# EAGLE design GRBL_Nano_V2 (EAGLE 9.5.2)
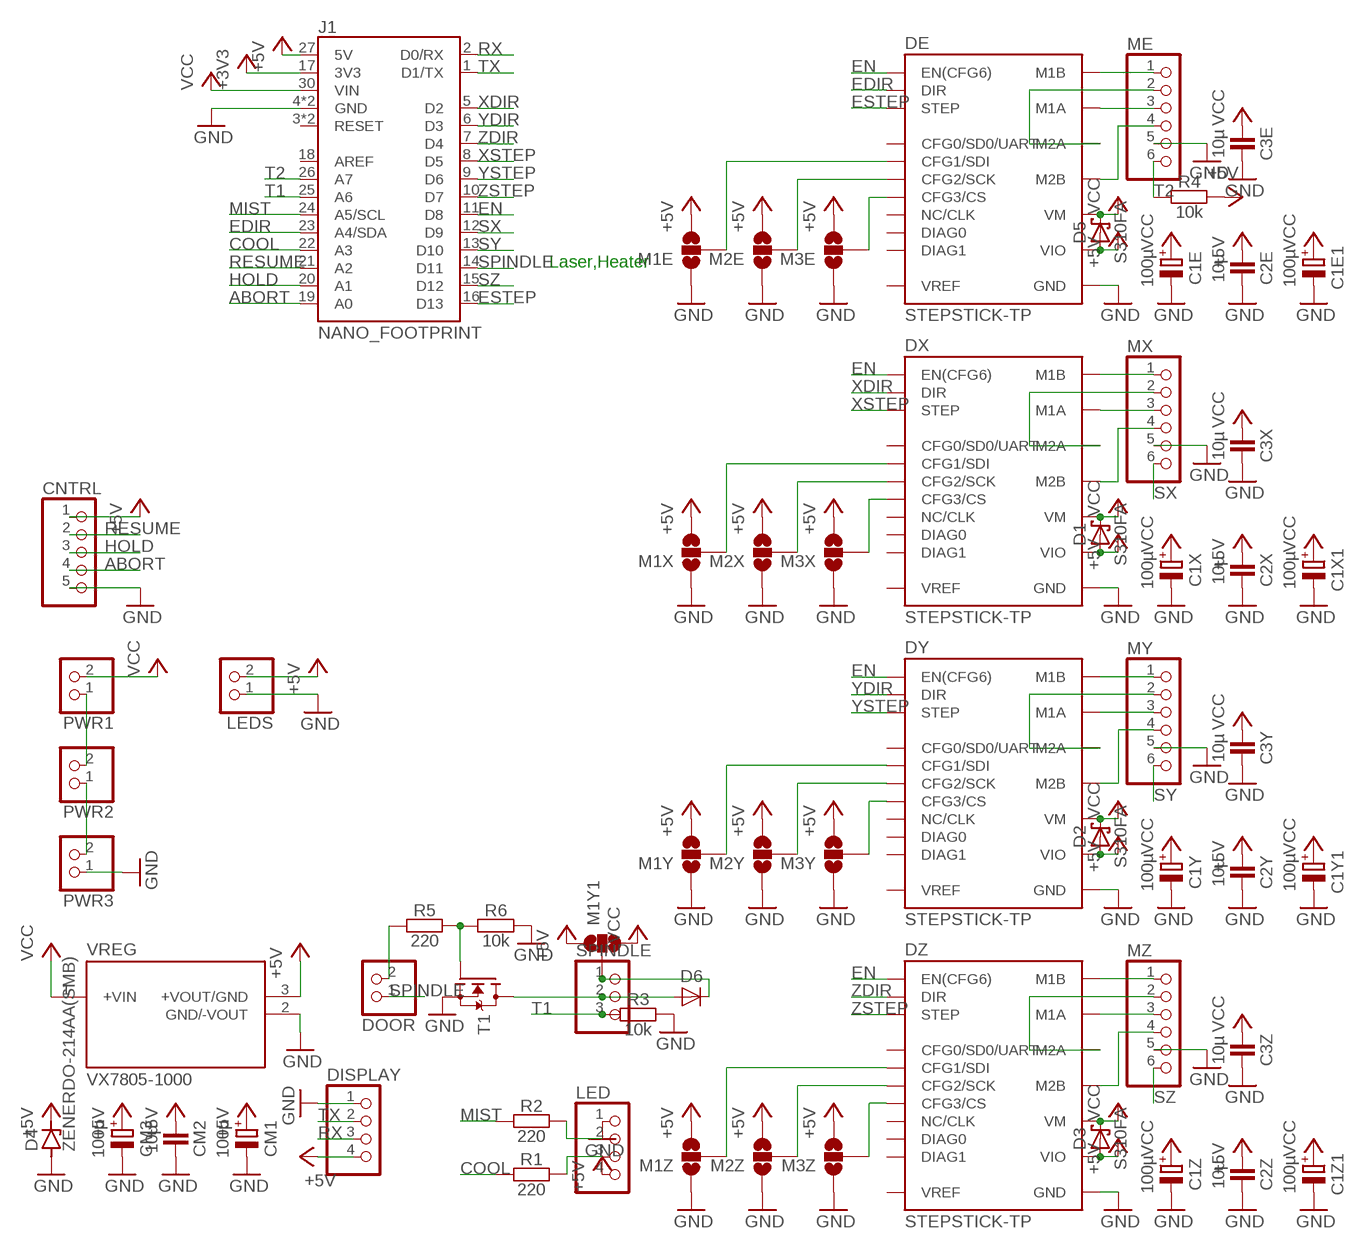
[diagram p0: schematic, sheet 1]

## Parts
C1E  100µ  CAPACITOR_POL-8MM  [C_8MM]
C1E1  100µ  CAPACITOR_POL-E5-10  [C_E5-10]
C1X  100µ  CAPACITOR_POL-8MM  [C_8MM]
C1X1  100µ  CAPACITOR_POL-E5-10  [C_E5-10]
C1Y  100µ  CAPACITOR_POL-8MM  [C_8MM]
C1Y1  100µ  CAPACITOR_POL-E5-10  [C_E5-10]
C1Z  100µ  CAPACITOR_POL-8MM  [C_8MM]
C1Z1  100µ  CAPACITOR_POL-E5-10  [C_E5-10]
C2E  10µ  CAPACITOR-0805  [C0805]
C2X  10µ  CAPACITOR-0805  [C0805]
C2Y  10µ  CAPACITOR-0805  [C0805]
C2Z  10µ  CAPACITOR-0805  [C0805]
C3E  10µ  CAPACITOR-0805  [C0805]
C3X  10µ  CAPACITOR-0805  [C0805]
C3Y  10µ  CAPACITOR-0805  [C0805]
C3Z  10µ  CAPACITOR-0805  [C0805]
CM1  100µ  CAPACITOR_POL-8MM  [C_8MM]
CM2  10µ  CAPACITOR-0805  [C0805]
CM3  100µ  CAPACITOR_POL-E5-10  [C_E5-10]
CNTRL  PINHD-1X5  [1X05]
D1  S310FA  D_SCHOTTKY-SOD123  [SOD123]
D2  S310FA  D_SCHOTTKY-SOD123  [SOD123]
D3  S310FA  D_SCHOTTKY-SOD123  [SOD123]
D4  ZENERDO-214AA(SMB)  [DIOM5336X265N]
D5  S310FA  D_SCHOTTKY-SOD123  [SOD123]
D6  DIODE-SMA  [SMA_DO214AC]
DE  STEPSTICK-TP  [SSS_TP]
DISPLAY  PINHD-1X4  [1X04]
DOOR  PINHD-1X2  [1X02]
DX  STEPSTICK-TP  [SSS_TP]
DY  STEPSTICK-TP  [SSS_TP]
DZ  STEPSTICK-TP  [SSS_TP]
J1  NANO_FOOTPRINT  [NANO]
LED  PINHD-1X4  [1X04]
LEDS  PINHD-1X2  [1X02]
M1E  SOLDERJUMPER_2WAY-OLDS  [SJ_3]
M1X  SOLDERJUMPER_2WAY-OLDS  [SJ_3]
M1Y  SOLDERJUMPER_2WAY-OLDS  [SJ_3]
M1Y1  SOLDERJUMPER_2WAY-OLDS  [SJ_3]
M1Z  SOLDERJUMPER_2WAY-OLDS  [SJ_3]
M2E  SOLDERJUMPER_2WAY-OLDS  [SJ_3]
M2X  SOLDERJUMPER_2WAY-OLDS  [SJ_3]
M2Y  SOLDERJUMPER_2WAY-OLDS  [SJ_3]
M2Z  SOLDERJUMPER_2WAY-OLDS  [SJ_3]
M3E  SOLDERJUMPER_2WAY-OLDS  [SJ_3]
M3X  SOLDERJUMPER_2WAY-OLDS  [SJ_3]
M3Y  SOLDERJUMPER_2WAY-OLDS  [SJ_3]
M3Z  SOLDERJUMPER_2WAY-OLDS  [SJ_3]
ME  PINHD-1X6  [1X06]
MX  PINHD-1X6  [1X06]
MY  PINHD-1X6  [1X06]
MZ  PINHD-1X6  [1X06]
PWR1  PINHD-1X2  [1X02]
PWR2  PINHD-1X2  [1X02]
PWR3  PINHD-1X2  [1X02]
R1  220  RESISTOR-0805  [C0805]
R2  220  RESISTOR-0805  [C0805]
R3  10k  RESISTOR-0805  [C0805]
R4  10k  RESISTOR-0805  [C0805]
R5  220  RESISTOR-0805  [C0805]
R6  10k  RESISTOR-0805  [C0805]
SPINDLE  PINHD-1X3  [1X03]
T1  MOSFET-N-DPAK  [DPAK_TO252]
VREG  VX7805-1000  [VX78012-1000_VX7805-1000]

## Nets
+3V3: J1.17(3V3)
+5V: C2E.1 C2X.1 C2Y.1 C2Z.1 CM1.+ CM2.1 CM3.+ CNTRL.1 D1.A D2.A D3.A D4.2(C) D5.A DE.VIO DISPLAY.4 DX.VIO DY.VIO DZ.VIO J1.27(5V) LED.4 LEDS.2 M1E.3 M1X.3 M1Y1.1 M1Y.3 M1Z.3 M2E.3 M2X.3 M2Y.3 M2Z.3 M3E.3 M3X.3 M3Y.3 M3Z.3 R4.2 VREG.3(+VOUT/GND)
ABORT: CNTRL.4 J1.19(A0)
COOL: J1.22(A3) R1.1
COOL1: LED.3 R1.2
EDIR: DE.DIR J1.23(A4/SDA)
EN: DE.EN(EN(CFG6)) DX.EN(EN(CFG6)) DY.EN(EN(CFG6)) DZ.EN(EN(CFG6)) J1.11(D8)
ESTEP: DE.STEP J1.16(D13)
GND: C1E1.- C1E.- C1X1.- C1X.- C1Y1.- C1Y.- C1Z1.- C1Z.- C2E.2 C2X.2 C2Y.2 C2Z.2 C3E.2 C3X.2 C3Y.2 C3Z.2 CM1.- CM2.2 CM3.- CNTRL.5 D4.1(A) DE.GND@1(GND) DE.GND@2(GND) DISPLAY.1 DX.GND@1(GND) DX.GND@2(GND) DY.GND@1(GND) DY.GND@2(GND) DZ.GND@1(GND) DZ.GND@2(GND) J1.4(GND) J1.29(GND) LED.1 LEDS.1 M1E.1 M1X.1 M1Y.1 M1Z.1 M2E.1 M2X.1 M2Y.1 M2Z.1 M3E.1 M3X.1 M3Y.1 M3Z.1 ME.5 MX.5 MY.5 MZ.5 PWR3.1 R3.2 R6.2 T1.3(S) VREG.2(GND/-VOUT)
HOLD: CNTRL.3 J1.20(A1)
MIST: J1.24(A5/SCL) R2.1
MIST1: LED.2 R2.2
N$1: DX.M1A MX.3
N$2: DX.M2B MX.4
N$3: DX.M2A MX.2
N$4: DX.M1B MX.1
N$5: DZ.M1B MZ.1
N$6: DZ.M1A MZ.3
N$7: DY.M1B MY.1
N$8: DY.M1A MY.3
N$9: DY.M2A MY.2
N$10: DZ.M2A MZ.2
N$11: DZ.M2B MZ.4
N$12: DY.M2B MY.4
N$13: D6.A SPINDLE.2 T1.2(D)
N$14: DOOR.2 R5.1
N$15: DX.CFG1(CFG1/SDI) M1X.2
N$16: DX.CFG2(CFG2/SCK) M2X.2
N$17: DX.CFG3(CFG3/CS) M3X.2
N$18: DY.CFG1(CFG1/SDI) M1Y.2
N$19: DY.CFG2(CFG2/SCK) M2Y.2
N$20: DY.CFG3(CFG3/CS) M3Y.2
N$21: DZ.CFG1(CFG1/SDI) M1Z.2
N$22: DZ.CFG2(CFG2/SCK) M2Z.2
N$23: DZ.CFG3(CFG3/CS) M3Z.2
N$24: DE.M2B ME.4
N$25: DE.M1B ME.1
N$26: PWR1.1 PWR2.2
N$27: D6.C M1Y1.2 SPINDLE.1
N$28: PWR2.1 PWR3.2
N$29: DE.M1A ME.3
N$30: DE.M2A ME.2
N$31: DE.CFG1(CFG1/SDI) M1E.2
N$32: DE.CFG2(CFG2/SCK) M2E.2
N$33: DE.CFG3(CFG3/CS) M3E.2
N$34: R5.2 R6.1 T1.1(G)
RESUME: CNTRL.2 J1.21(A2)
RX: DISPLAY.3 J1.2(D0/RX)
SPINDLE: DOOR.1 J1.14(D11)
SX: J1.12(D9) MX.6
SY: J1.13(D10) MY.6
SZ: J1.15(D12) MZ.6
T1: J1.25(A6) R3.1 SPINDLE.3
T2: J1.26(A7) ME.6 R4.1
TX: DISPLAY.2 J1.1(D1/TX)
VCC: C1E1.+ C1E.+ C1X1.+ C1X.+ C1Y1.+ C1Y.+ C1Z1.+ C1Z.+ C3E.1 C3X.1 C3Y.1 C3Z.1 D1.C D2.C D3.C D5.C DE.VM DX.VM DY.VM DZ.VM J1.30(VIN) M1Y1.3 PWR1.2 VREG.1(+VIN)
XDIR: DX.DIR J1.5(D2)
XSTEP: DX.STEP J1.8(D5)
YDIR: DY.DIR J1.6(D3)
YSTEP: DY.STEP J1.9(D6)
ZDIR: DZ.DIR J1.7(D4)
ZSTEP: DZ.STEP J1.10(D7)
Unconnected: DE.CFG0/NC(CFG0/SD0/UART) DE.CLK/NC(NC/CLK) DE.DIAG0 DE.DIAG1 DE.VREF DX.CFG0/NC(CFG0/SD0/UART) DX.CLK/NC(NC/CLK) DX.DIAG0 DX.DIAG1 DX.VREF DY.CFG0/NC(CFG0/SD0/UART) DY.CLK/NC(NC/CLK) DY.DIAG0 DY.DIAG1 DY.VREF DZ.CFG0/NC(CFG0/SD0/UART) DZ.CLK/NC(NC/CLK) DZ.DIAG0 DZ.DIAG1 DZ.VREF J1.3(RESET) J1.18(AREF) J1.28(RESET)

## Notes on the sheet
- Laser,Heater

## Library data of the parts
C1E C1E1 C1X C1X1 C1Y C1Y1 C1Z C1Z1 CM1 CM3 = we-rcl:CAPACITOR_POL: Capacitor (Polarized)
C2E C2X C2Y C2Z C3E C3X C3Y C3Z CM2 = we-rcl:CAPACITOR: Capacitor ...2.2uF @ 6.3V -> 0402 ...4.7uF @ 6.3V -> 0603 ...10uF @ 16V -> 0805 ...22uF @ 25V -> 1206
CNTRL = Connector:PINHD-1X5: PIN HEADER; CATEGORY: CONNECTOR; SUB-CATEGORY: PIN-HEADER
D1-D3 D5 = we-rcl:D_SCHOTTKY: Schottky Diode 1A, 30V - SOD323 (BAS3010B) 3A, 100V - SOD123 (S310A)
D4 = Diode:ZENER: Zener Diode - Generic; CATEGORY: Diode; SUB-CATEGORY: Zener
D6 = we-rcl:DIODE: Diode
DE DX DY DZ = we-board:STEPSTICK: SilentStepStick Trinamic TMC2xxx Stepper Motor Driver TMC2100 - CFG pins for configuration TMC2130 - CFG pins and SPI for configuration TMC220x - CFG pins and UART for configuration
DISPLAY LED = Connector:PINHD-1X4: PIN HEADER; CATEGORY: CONNECTOR; SUB-CATEGORY: PIN-HEADER
DOOR LEDS PWR1-PWR3 = Connector:PINHD-1X2: PIN HEADER; CATEGORY: CONNECTOR; SUB-CATEGORY: PIN-HEADER
J1 = SparkFun-Boards:NANO_FOOTPRINT: Generic Nano Footprint
M1E M1X M1Y M1Y1 M1Z M2E M2X M2Y M2Z M3E M3X M3Y M3Z = SparkFun-Retired:SOLDERJUMPER_2WAY-OLD: Solder Jumper 2 way solder jumper
ME MX MY MZ = Connector:PINHD-1X6: PIN HEADER; CATEGORY: CONNECTOR; SUB-CATEGORY: PIN-HEADER
R1-R6 = we-rcl:RESISTOR: Resistor all kinds in 0402 and 0603
SPINDLE = Connector:PINHD-1X3: PIN HEADER; CATEGORY: CONNECTOR; SUB-CATEGORY: PIN-HEADER
T1 = we-transistor:MOSFET-N: N-Chn MOSFET SOT23 N-Chn MOSFET TSM3404, TSM240N03 (Vgs>=+/-20V, Vds>=30V, Id>=3A + Rds<=0.05Ohm @ Vgs=4.5V) BSS138 (Vgs>=+/-20V, Vds>=40V, Id>=0.2A + Rds<=3Ohm @ Vgs=4.5V) SOT223 Low Side Switch with Protection (Infineon) BSP76 (Vin=0...10V, Vds=42V, Id=1.4A + Rds=0.2Ohm @ Vin=5V) BSP77 (Vin=0...10V, Vds=42V, Id=2.2A + Rds=0.1Ohm @ Vin=5V) D²Pak Low Side Switch with Protection (Infineon) BTS117TC (Vin=0...10V, Vds=60V, Id=3.5A + Rds=0.12Ohm @ Vin=5V) BTS133TC (Vin=0...10V, Vds=60V, Id=7A + Rds=0.06Ohm @ Vin=5V) BTS141TC (Vin=0...10V, Vds=60V, Id=12A + Rds=0.03Ohm @ Vin=5V) BTS3018TC (Vin=0...10V, Vds=60V, Id=6A + Rds=0.02Ohm @ Vin=5V)
VREG = VX7805-1000:VX7805-1000: Check availability <https://pricing.snapeda.com/parts/VX7805-1000/CUI%20Inc./view-part?ref=eda>; AVAILABILITY: In Stock; CHECK_PRICES: https://www.snapeda.com/parts/VX7805-1000/CUI/view-part/?ref=eda; CUI_PURCHASE_URL: https://www.cui.com/product/dc-dc-converters/non-isolated/vx78-1000-series?utm_source=snapeda.com&utm_medium=referral&utm_campaign=snapedaBOM; DESCRIPTION: 1 A Output Current, 6~36 Vdc Input, 3 Pin SIP, Non-Isolated, Dc-Dc Converter; MF: CUI Inc.; MP: VX7805-1000; PACKAGE: SIP-3 CUI; PRICE: None; SNAPEDA_LINK: https://www.snapeda.com/parts/VX7805-1000/CUI/view-part/?ref=snap

## Board
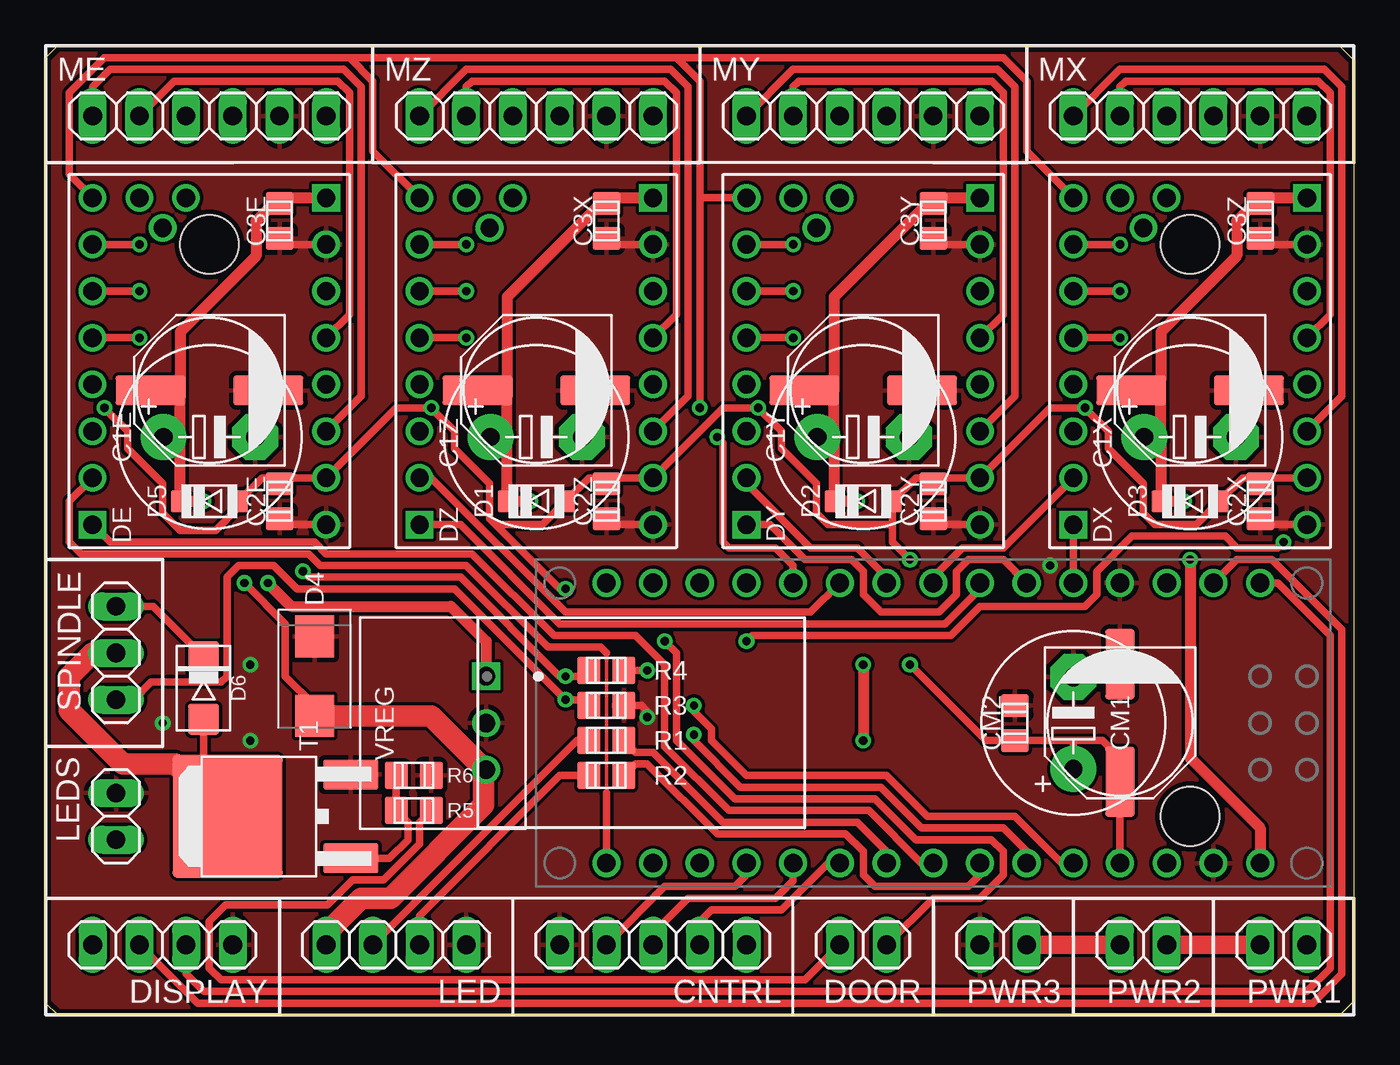
[diagram p1: board, top side]
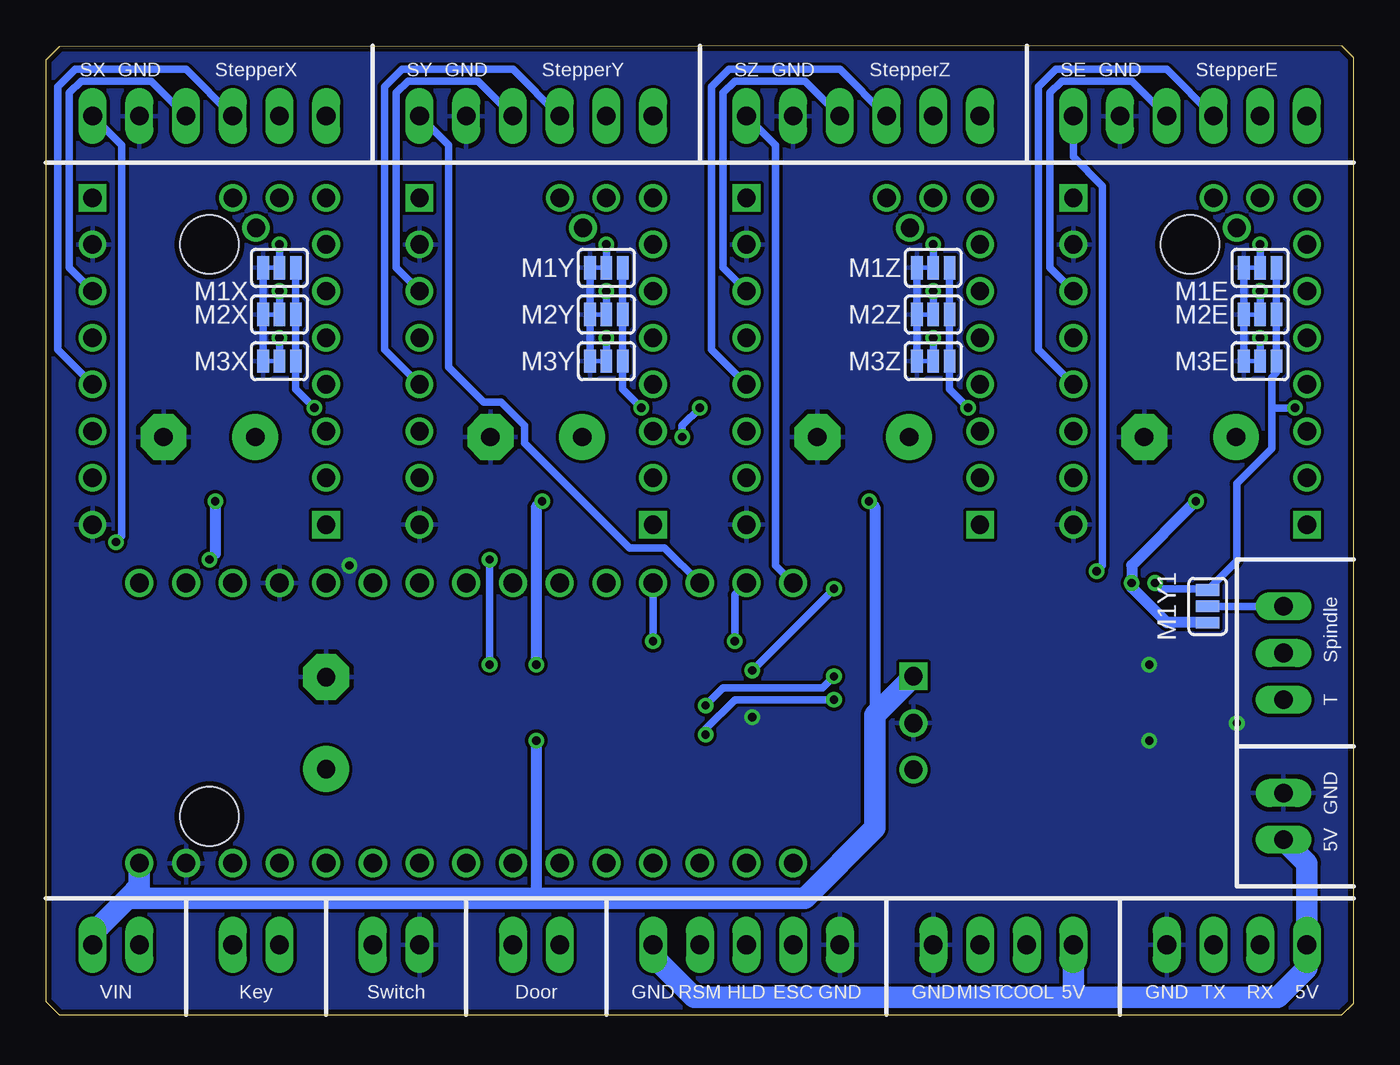
[diagram p2: board, bottom side, seen from below]

Size 71.12 x 52.7 mm. Coordinates in mm from the lower left corner, seen from the top.
Outline: 71.12,0.73 70.39,0 0.64,0 0,0.64 0,52.07 0.64,52.7 70.39,52.65 71.12,51.92 71.12,0.73
Copper layers (1*16): Top 0.035mm / dielectric 1.5mm / Bottom 0.035mm
Design rules "aisler_2_layer_simple": minimum track width 0.2mm, minimum drill 0.45mm, track to track 0.175mm, track to pad 0.175mm, pad to pad 0.175mm, via to via 0.175mm, smd to smd 0.175mm, copper to edge 0.3mm, drill to drill 0.25mm, minimum pad ring 0.2mm, minimum via ring 0.2mm, stop-mask expansion 0mil, vias tented up to drill 0mil, thermal gap 10mil
Holes 3.2 mm at 62.23,10.79 62.23,41.91 8.89,41.91

### Footprints (pad centres in the part's own frame; a part is rotated, then mirrored left to right if it is on the bottom)
C_8MM = smd 1.6 x 3.8: + 0,3.2; - 0,-3.2
C_E5-10 = drill 1 pad 2.5: + 0,2.5 | drill 1 pad 2.5 octagon: - 0,-2.5
C0805 = smd 1.5 x 1.25: 1 0,0.95; 2 0,-0.95
1X05 = drill 1.016 long: 1 -5.08,0; 2 -2.54,0; 3 0,0; 4 2.54,0; 5 5.08,0
SOD123 = smd 1.2 x 1: A 0,-1.6; C 0,1.6
DIOM5336X265N = smd 2.284 x 2.124: 1 -2.164,0; 2 2.164,0
SMA_DO214AC = smd 1.7 x 1.7: A 0,-1.7; C 0,1.7
SSS_TP = drill 1: CFG0/NC -6.35,-1.27; CFG1 -6.35,6.35; CFG2 -6.35,3.81; CFG3 -6.35,1.27; CLK/NC -6.35,-3.81; DIAG0 -2.54,7.239; DIAG1 -1.27,8.89; EN -6.35,8.89; GND@1 6.35,6.35; GND@2 6.35,-8.89; M1A 6.35,-1.27; M1B 6.35,-3.81; M2A 6.35,1.27; M2B 6.35,3.81; STEP -6.35,-6.35; VIO 6.35,-6.35; VREF -3.81,8.89 | drill 1 square: DIR -6.35,-8.89; VM 6.35,8.89
1X04 = drill 1.016 long: 1 -3.81,0; 2 -1.27,0; 3 1.27,0; 4 3.81,0
1X02 = drill 1.016 long: 1 -1.27,0; 2 1.27,0
NANO = drill 1.016: 1 -7.62,17.78; 2 -7.62,15.24; 3 -7.62,12.7; 4 -7.62,10.16; 5 -7.62,7.62; 6 -7.62,5.08; 7 -7.62,2.54; 8 -7.62,0; 9 -7.62,-2.54; 10 -7.62,-5.08; 11 -7.62,-7.62; 12 -7.62,-10.16; 13 -7.62,-12.7; 14 -7.62,-15.24; 15 -7.62,-17.78; 16 7.62,-17.78; 17 7.62,-15.24; 18 7.62,-12.7; 19 7.62,-10.16; 20 7.62,-7.62; 21 7.62,-5.08; 22 7.62,-2.54; 23 7.62,0; 24 7.62,2.54; 25 7.62,5.08; 26 7.62,7.62; 27 7.62,10.16; 28 7.62,12.7; 29 7.62,15.24; 30 7.62,17.78
SJ_3 = smd 0.635 x 1.27: 1 -0.889,0; 2 0,0; 3 0.889,0
1X06 = drill 1.016 long: 1 -6.35,0; 2 -3.81,0; 3 -1.27,0; 4 1.27,0; 5 3.81,0; 6 6.35,0
1X03 = drill 1.016 long: 1 -2.54,0; 2 0,0; 3 2.54,0
DPAK_TO252 = smd 3 x 1.6: 1 -4.2,2.28; 3 -4.2,-2.28 | smd 6 x 6.7: 2 2.5,0
VX78012-1000_VX7805-1000 = drill 1 square: 1 -2.54,2.35 | drill 1: 2 0,2.35; 3 2.54,2.35

### Placement (x,y rotation side)
C1E  8.89,33.97 90 top
C1E1  8.89,31.43 90 top
C1X  62.23,33.97 90 top
C1X1  26.67,31.43 90 top
C1Y  44.45,33.97 90 top
C1Y1  44.45,31.43 90 top
C1Z  26.67,33.97 90 top
C1Z1  62.23,31.43 90 top
C2E  12.7,27.94 0 top
C2X  66.04,27.94 0 top
C2Y  48.26,27.94 0 top
C2Z  30.48,27.94 0 top
C3E  12.7,43.18 0 top
C3X  30.48,43.18 0 top
C3Y  48.26,43.18 0 top
C3Z  66.04,43.18 0 top
CM1  58.42,15.88 180 top
CM2  52.7,15.88 180 top
CM3  55.88,15.88 180 top
CNTRL  33.02,3.81 180 top
D1  26.67,27.94 90 top
D2  44.45,27.94 90 top
D3  62.23,27.94 90 top
D4  14.61,18.41 270 top
D5  8.89,27.94 90 top
D6  8.57,17.78 0 top
DE  8.89,35.56 0 top
DISPLAY  6.35,3.81 180 top
DOOR  44.45,3.81 180 top
DX  62.23,35.56 0 top
DY  44.45,35.56 0 top
DZ  26.67,35.56 0 top
J1  48.26,15.88 270 top
LED  19.05,3.81 180 top
LEDS  3.81,10.79 270 top
M1E  5.08,40.64 0 bottom
M1X  58.42,40.64 0 bottom
M1Y  40.64,40.64 0 bottom
M1Y1  7.94,22.23 270 bottom
M1Z  22.86,40.64 0 bottom
M2E  5.08,38.1 0 bottom
M2X  58.42,38.1 0 bottom
M2Y  40.64,38.1 0 bottom
M2Z  22.86,38.1 0 bottom
M3E  5.08,35.56 0 bottom
M3X  58.42,35.56 0 bottom
M3Y  40.64,35.56 0 bottom
M3Z  22.86,35.56 0 bottom
ME  8.89,48.9 0 top
MX  62.23,48.9 0 top
MY  44.45,48.9 0 top
MZ  26.67,48.9 0 top
PWR1  67.31,3.81 0 top
PWR2  59.69,3.81 0 top
PWR3  52.07,3.81 0 top
R1  30.48,14.92 270 top
R2  30.48,13.02 270 top
R3  30.48,16.83 90 top
R4  30.48,18.73 90 top
R5  20,11.11 270 top
R6  20,13.02 90 top
SPINDLE  3.81,19.68 270 top
T1  12.38,10.79 180 top
VREG  21.59,15.88 270 top

### Tracks (layer width: path | path; a pad name or v marks a point on that pad's centre or on a via)
+5V  (via drill 0.45)
  Top 0.406: DX.VIO 66.36,29.21 C2X.1 65.72,28.89 65.41,29.21 65.1,29.21 D3.A 62.56,26.67 60.32,26.67 59.69,27.3 59.69,28.89 57.78,30.8 57.78,31.75 v56.52,33.02 54.61,33.02 DY.VIO 48.58,29.21 C2Y.1 47.94,29.21 47.32,29.21 D2.A 46.04,27.93 46.04,26.67 | J1.27 CM1.+ 58.42,13.97 57.47,14.93 55.88,14.93 | 55.88,14.93 CM2.1 51.12,14.93 v46.99,19.05 | 24.45,26.67 24.13,26.99 24.13,28.89 22.23,30.8 22.23,31.75 v20.95,33.02 19.05,33.02 DE.VIO 13.02,29.21 C2E.1 12.38,28.89 12.06,29.21 11.76,29.21 D5.A 10.49,27.62 9.22,26.35 7.3,26.35 6.35,27.3 6.35,28.89 4.45,30.8 4.45,31.75 v3.17,33.02 | 46.04,26.67 42.55,26.67 41.91,27.3 41.91,28.89 40.01,30.8 40.01,31.75 v38.73,33.02 36.83,33.02 DZ.VIO 30.8,29.21 C2Z.1 30.16,28.89 29.84,29.21 29.54,29.21 D1.A 27,26.67 24.45,26.67 | R4.2 v32.7,18.73 | v28.26,23.18 28.1,23.02 24.45,26.67 | D4.2 14.61,16.83 13.02,18.41 13.02,21.27 v10.79,23.5 | v46.99,24.77 46.04,25.72 46.04,26.67 | CM3.+ 55.88,14.93
  Top 1.016: D4.2 14.61,16.13
  Top 1.168: D4.2 20.95,16.25 23.81,13.39 23.88,13.39 VREG.3 | LED.4 15.24,4.45 17.14,6.35 18.73,6.35 23.81,11.43 23.81,13.34 VREG.3 | VREG.3
  Bottom 0.406: M1Y.3 M2Y.3 M3Y.3 39.75,34.04 v38.73,33.02 | M1X.3 M2X.3 M3X.3 57.53,34.04 v56.52,33.02 | M1Z.3 M2Z.3 M3Z.3 21.97,34.04 v20.95,33.02 | M2E.3 M3E.3 | M3E.3 M1E.3 | M3E.3 4.19,34.92 4.45,34.67 4.45,33.02 | 4.45,33.02 v3.17,33.02 | 4.45,33.02 4.45,30.8 6.35,28.89 6.35,24.7 M1Y1.1 8,23.18 10.48,23.18 v10.79,23.5 | v32.7,18.73 v28.26,23.18 | v46.99,19.05 v46.99,24.77
  Bottom 1.168: CNTRL.1 38.1,3.17 35.88,0.95 15.24,0.95 | 15.24,0.95 LED.4 | 15.24,0.95 4.13,0.95 2.54,2.54 DISPLAY.4 2.54,8.26 LEDS.2
ABORT
  Top 0.406: J1.19 38.1,7.62 37.47,6.99 33.66,6.99 CNTRL.4
COOL
  Top 0.406: J1.22 45.72,8.89 44.13,10.48 36.83,10.48 33.02,14.29 32.06,14.29 R1.1
COOL1
  Top 0.406: R1.2 28.89,14.92 26.04,12.06 LED.3
EDIR
  Top 0.406: DE.DIR 3.49,25.72 14.61,25.72 15.24,25.08 23.18,25.08 27.62,20.64 32.07,20.64 33.66,19.05 33.66,14.61 37.15,11.11 44.77,11.11 47.62,8.26 J1.23
EN  (via drill 0.45)
  Top 0.406: DX.EN 53.34,46.99 53.34,50.8 52.07,52.07 35.56,52.07 34.29,52.07 | DE.EN 1.27,45.72 1.27,50.16 3.17,52.07 16.51,52.07 | 34.29,52.07 17.78,52.07 16.51,52.07 | DY.EN 35.56,44.45 | DZ.EN 17.78,46.99 17.78,50.8 16.51,52.07 | J1.11 40.64,24.45 39.69,25.4 37.15,25.4 36.83,25.72 36.83,31.11 v36.51,31.43 | 34.29,52.07 35.56,50.8 35.56,44.45 | 35.56,44.45 v35.56,33.02
  Bottom 0.406: v36.51,31.43 36.51,32.07 v35.56,33.02
ESTEP
  Top 0.203: 30.48,19.68 30.48,12.06
  Top 0.406: DE.STEP 1.27,27.94 1.27,25.72 1.91,25.08 14.29,25.08 14.92,24.45 22.86,24.45 27.3,20 30.16,20 30.48,19.68 | 30.48,12.06 J1.16
GND  (via drill 0.45)
  Top 0.406: C3Y.2 48.58,41.91 DY.GND@1 | C2Y.2 48.58,26.67 DY.GND@2 | C2X.2 66.36,26.67 DX.GND@2 | C3Z.2 66.36,41.91 DX.GND@1 | C3X.2 30.8,41.91 DZ.GND@1 | C2Z.2 30.8,26.67 DZ.GND@2 | C2E.2 13.02,26.67 DE.GND@2 | C3E.2 13.02,41.91 DE.GND@1 | v32.7,16.19 32.7,16.51 32.38,16.83 R3.2
  Bottom 0.406: M3Y.1 M2Y.1 M1Y.1 | M1X.1 M2X.1 M3X.1 | M1Z.1 M2Z.1 M3Z.1 | M1E.1 M3E.1 M2E.1
  other vias: 54.61,24.45 11.11,19.05 11.11,14.92 6.35,15.88
  pour Bottom: 71.12,0 71.12,52.7 0,52.7 0,0
  pour Top: 71.12,0 71.12,52.7 0,52.7 0,0
HOLD
  Top 0.406: J1.20 40.64,7.3 39.69,6.35 34.92,6.35 33.02,4.45 CNTRL.3
MIST
  Top 0.406: J1.24 50.8,7.62 50.16,6.99 45.09,6.99 44.45,7.62 44.45,8.89 43.5,9.84 36.51,9.84 32.7,13.65 32.06,13.65 R2.1
MIST1
  Top 0.406: R2.2 27.94,13.02 20.32,5.4 LED.2
N$1
  Bottom 0.406: DX.M1A 70.48,36.2 70.48,50.48 69.53,51.44 63.5,51.44 MX.3
N$2
  Bottom 0.406: DX.M2B 69.85,40.64 69.85,50.16 69.22,50.8 65.41,50.8 MX.4
N$3
  Top 0.406: DX.M2A 69.85,38.1 69.85,50.16 69.22,50.8 58.74,50.8 58.42,50.48 MX.2
N$4
  Top 0.406: DX.M1B 70.48,33.66 70.48,50.48 69.53,51.44 58.42,51.44 MX.1
N$5
  Top 0.406: DZ.M1B 34.92,33.66 34.92,50.48 33.97,51.44 22.86,51.44 MZ.1
N$6
  Bottom 0.406: DZ.M1A 34.92,36.2 34.92,50.48 33.97,51.44 27.94,51.44 MZ.3
N$7
  Top 0.406: DY.M1B 52.7,33.66 52.7,50.48 51.75,51.44 40.64,51.44 MY.1
N$8
  Bottom 0.406: DY.M1A 52.7,36.2 52.7,50.48 51.75,51.44 45.72,51.44 MY.3
N$9
  Top 0.406: DY.M2A 52.07,38.1 52.07,50.16 51.44,50.8 40.95,50.8 40.64,50.48 MY.2
N$10
  Top 0.406: DZ.M2A 34.29,38.1 34.29,50.16 33.66,50.8 23.18,50.8 22.86,50.48 MZ.2
N$11
  Bottom 0.406: DZ.M2B 34.29,40.64 34.29,50.16 33.66,50.8 29.84,50.8 MZ.4
N$12
  Bottom 0.406: DY.M2B 52.07,40.64 52.07,50.16 51.44,50.8 47.62,50.8 MY.4
N$13
  Top 0.406: D6.A 8.57,12.11 8.75,11.93
  Top 1.168: SPINDLE.2 2.54,19.68 1.27,18.41 1.27,16.55 4.17,13.65 7.03,13.65 8.75,11.93 T1.2
N$14
  Top 0.406: DOOR.2 41.27,1.91 9.53,1.91 8.89,2.54 8.89,5.08 9.79,5.97 15.31,5.97 16.67,7.34 18.36,7.34 20.32,9.3 20.32,10.48 R5.1
N$15  (via drill 0.45)
  Top 0.406: DX.CFG1 v58.42,41.91
  Bottom 0.254: M1X.2 59.37,40.64
  Bottom 0.406: v58.42,41.91 M1X.2
N$16  (via drill 0.45)
  Top 0.406: v58.42,39.37 DX.CFG2
  Bottom 0.254: M2X.2 59.37,38.1
  Bottom 0.406: M2X.2 v58.42,39.37
N$17  (via drill 0.45)
  Top 0.406: DX.CFG3 v58.42,36.83
  Bottom 0.254: M3X.2 59.37,35.56
  Bottom 0.406: v58.42,36.83 M3X.2
N$18  (via drill 0.45)
  Top 0.406: DY.CFG1 v40.64,41.91
  Bottom 0.254: M1Y.2 41.59,40.64
  Bottom 0.406: v40.64,41.91 M1Y.2
N$19  (via drill 0.45)
  Top 0.406: DY.CFG2 v40.64,39.37
  Bottom 0.254: M2Y.2 41.59,38.1
  Bottom 0.406: v40.64,39.37 M2Y.2
N$20  (via drill 0.45)
  Top 0.406: DY.CFG3 v40.64,36.83
  Bottom 0.254: M3Y.2 41.59,35.56
  Bottom 0.406: v40.64,36.83 M3Y.2
N$21  (via drill 0.45)
  Top 0.406: v22.86,41.91 DZ.CFG1
  Bottom 0.254: M1Z.2 23.81,40.64
  Bottom 0.406: M1Z.2 v22.86,41.91
N$22  (via drill 0.45)
  Top 0.406: DZ.CFG2 v22.86,39.37
  Bottom 0.254: M2Z.2 23.81,38.1
  Bottom 0.406: v22.86,39.37 M2Z.2
N$23  (via drill 0.45)
  Top 0.406: v22.86,36.83 DZ.CFG3
  Bottom 0.254: M3Z.2 23.81,35.56
  Bottom 0.406: M3Z.2 v22.86,36.83
N$24
  Bottom 0.406: DE.M2B 16.51,40.64 16.51,50.16 15.88,50.8 12.06,50.8 ME.4
N$25
  Top 0.406: DE.M1B 17.14,33.66 17.14,50.48 16.19,51.44 3.49,51.44 2.54,50.48 ME.1
N$26
  Top 1.016: PWR2.2 PWR1.1
N$27
  Top 0.406: SPINDLE.1 5.83,22.23 D6.C
  Bottom 0.406: SPINDLE.1 M1Y1.2
N$28
  Top 1.016: PWR2.1 PWR3.2
N$29
  Bottom 0.406: DE.M1A 17.14,36.2 17.14,50.48 16.19,51.44 10.16,51.44 ME.3
N$30
  Top 0.406: DE.M2A 16.51,38.1 16.51,50.16 15.88,50.8 6.99,50.8 ME.2
N$31  (via drill 0.45)
  Top 0.406: DE.CFG1 v5.08,41.91
  Bottom 0.254: M1E.2 6.03,40.64
  Bottom 0.406: v5.08,41.91 M1E.2
N$32  (via drill 0.45)
  Top 0.406: v5.08,39.37 DE.CFG2
  Bottom 0.254: M2E.2 6.03,38.1
  Bottom 0.406: M2E.2 v5.08,39.37
N$33  (via drill 0.45)
  Top 0.406: DE.CFG3 v5.08,36.83
  Bottom 0.254: M3E.2 6.03,35.56
  Bottom 0.406: v5.08,36.83 M3E.2
N$34
  Top 0.406: R6.1 R5.2 19.69,10.48 19.69,9.53 18.68,8.52 T1.1
RESUME
  Top 0.406: J1.21 42.55,8.26 40.01,5.71 36.2,5.71 35.56,5.08 CNTRL.2
RX
  Top 0.406: DISPLAY.3 8.26,0.64 68.9,0.64 70.48,2.22 70.48,20.95 66.67,24.77 64.77,24.77 J1.2
SPINDLE  (via drill 0.45)
  Top 0.406: DOOR.1 48.26,6.35 50.8,6.35 52.07,7.62 52.07,8.89 51.44,9.53 47.31,9.53 45.09,11.75 37.47,11.75 34.29,14.92 34.29,19.68 v33.66,20.32
  Bottom 0.406: J1.14 33.66,22.86 v33.66,20.32
SX  (via drill 0.45)
  Top 0.406: v67.31,25.72 66.99,25.4 64.77,25.4 64.14,26.04 59.05,26.04 57.15,24.13 57.15,22.86 56.52,22.23 50.8,22.23 49.21,20.64 38.42,20.64 v38.1,20.32
  Bottom 0.406: MX.6 66.99,47.31 66.99,26.04 v67.31,25.72 | v38.1,20.32 J1.12
SY
  Bottom 0.406: MY.6 49.21,47.31 49.21,35.24 47.31,33.34 46.35,33.34 45.09,32.07 45.09,31.11 39.37,25.4 37.47,25.4 J1.13
SZ
  Bottom 0.406: MZ.6 31.43,47.31 31.43,24.45 J1.15
T1  (via drill 0.45)
  Top 0.406: v35.24,15.24 35.24,14.92 37.78,12.38 45.4,12.38 47.62,10.16 52.07,10.16 53.34,8.89 J1.25 | SPINDLE.3 4.76,17.14 5.71,18.1 9.53,18.1 9.84,18.41 9.84,23.81 10.48,24.45 12.38,24.45 13.65,23.18 22.23,23.18 v28.26,17.14 29.21,17.14 R3.1
  Bottom 0.406: v28.26,17.14 33.66,17.14 35.24,15.56 v35.24,15.24
T2  (via drill 0.45)
  Top 0.406: v13.97,24.13 14.29,23.81 22.54,23.81 27.94,18.41 v28.26,18.41 29.21,18.41 R4.1 | v35.24,16.83 35.24,16.51 36.2,15.56 36.2,14.92 38.1,13.02 45.72,13.02 47.94,10.79 52.7,10.79 55.24,8.26 J1.26
  Bottom 0.406: ME.6 15.24,46.67 13.65,45.09 13.65,24.45 v13.97,24.13 | v28.26,18.41 28.89,17.78 34.29,17.78 v35.24,16.83
TX
  Top 0.406: DISPLAY.2 7.62,2.22 8.57,1.27 68.58,1.27 69.85,2.54 69.85,20.64 66.99,23.5 J1.1
VCC  (via drill 0.45)
  Top 0.406: 48.58,44.45 C3Y.1 47.94,44.13 | C3X.1 30.32,44.29 | 23.79,33.66 C1Z.+ | 42.86,33.97 42.55,33.66 42.23,33.97 C1Y.+ | 60.64,34.61 60.01,33.97 | 7.3,33.66 6.01,33.66 C1E.+
  Top 0.61: 48.58,44.45 DY.VM | DX.VM 66.36,44.45 C3Z.1 65.72,44.13 64.77,43.18 64.77,41.27 60.64,37.15 60.64,34.61 60.64,31.43 | DZ.VM 30.8,44.45 C3X.1 | DE.VM 13.02,44.45 C3E.1 12.38,44.13 11.43,43.18 11.43,41.27 7.3,37.15 7.3,33.66 7.3,31.43 7.29,31.43 | v12.06,23.5 13.34,22.23 22.04,22.23 23.94,20.32 VREG.1 | 30.32,44.29 25.08,39.05 25.08,33.66 | 25.08,33.66 23.79,33.66 | 47.94,44.13 42.86,39.05 42.86,33.97 42.86,31.43 | 60.01,33.97 C1X.+ | 7.29,31.43 D5.C v8.57,27.94 | 25.07,31.43 D1.C v26.35,27.94 | 25.08,33.66 25.08,31.43 25.07,31.43 | 42.86,31.43 42.86,27.95 D2.C v44.13,27.94 | 60.64,31.43 60.64,27.95 D3.C v61.91,27.94 | v44.45,19.05 v44.45,14.92 | v62.23,24.77 62.23,13.97 66.04,10.16 J1.30 | C1X1.+ 25.07,31.43 | C1E1.+ 7.29,31.43 | C1Y1.+ 42.86,31.43 | C1Z1.+ 60.64,31.43
  Bottom 0.61: M1Y1.3 10.16,21.34 12.06,23.24 v12.06,23.5 12.06,24.45 v8.57,27.94 | v26.35,27.94 26.04,27.62 26.04,15.88 | v44.13,27.94 44.45,27.62 v44.45,19.05 | v44.45,14.92 44.45,6.35 | v61.91,27.94 61.91,25.08 v62.23,24.77
  Bottom 1.168: 66.67,6.35 66.04,6.99 J1.30 | 66.67,6.35 44.45,6.35 29.84,6.35 26.04,10.16 26.04,15.88 26.04,16.32 VREG.1 | PWR1.2 68.58,4.45 66.67,6.35
XDIR
  Top 0.406: J1.5 DX.DIR
XSTEP
  Top 0.406: J1.8 48.26,23.81 49.85,25.4 52.07,25.4 DX.STEP
YDIR
  Top 0.406: DY.DIR 39.37,26.67 41.27,24.77 43.81,24.77 44.45,24.13 44.45,22.86 45.4,21.91 48.58,21.91 49.53,22.86 49.53,24.13 50.16,24.77 52.07,24.77 J1.6 52.7,24.13
YSTEP
  Top 0.406: DY.STEP 38.1,28.89 41.59,25.4 44.13,25.4 45.72,23.81 J1.9
ZDIR
  Top 0.406: DZ.DIR 22.54,26.67 27.94,21.27 48.9,21.27 50.8,23.18 J1.7
ZSTEP
  Top 0.406: DZ.STEP 20.95,29.21 28.26,21.91 41.59,21.91 J1.10

### Text on the board
bNames: StepperE | GND | SE | StepperZ | GND | SZ | StepperY | GND | SY | StepperX | GND | SX | Spindle | T | GND | 5V | 5V | RX | TX | GND | 5V | COOL | MIST | GND | GND | ESC | HLD | RSM | GND | Door | Switch | Key | VIN